# Altium schematic sheet 2_MEMORY.schdoc
size 307 x 218 mm; Symbol: Drawing-Symbol_A4; Device: Drawing-Symbol_A4; Company: 嘉立创EDA; Version: V1.0; Page Size: A4; @Project Name: 工程文件; @Page Count: 7; @Update Date: 2025-06-13; @Create Date: 2025-06-12; @Schematic Name: Schematic1; @Page No: 2; @Page Name: MEMORY; @Create Time: 03:04:20; @Update Time: 17:04:07; Width: 1170; Height: 825; Region Start: 1; X Region Count: 6; Y Region Count: 4; Blade Width: 10; Title Block Position: 3; @Board Name: Board1
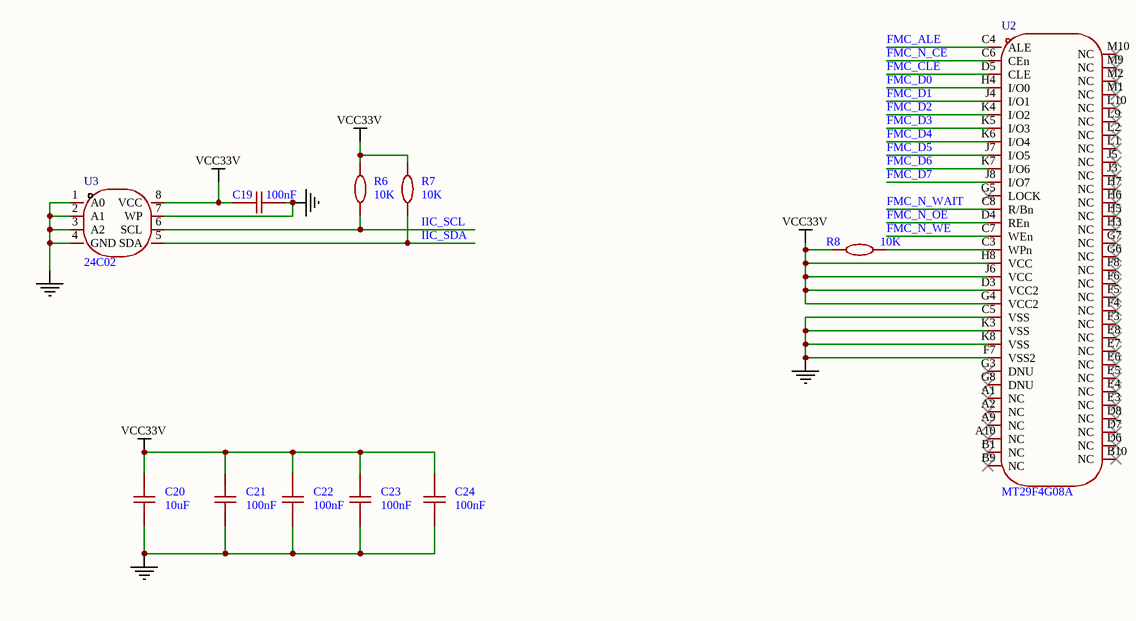
[diagram p0: 2_MEMORY.schdoc]

## Parts
C19  100nF  [C0402]
C20  10uF  [C0603]
C21  100nF  [C0402]
C22  100nF  [C0402]
C23  100nF  [C0402]
C24  100nF  [C0402]
R6  10K  [R0402]
R7  10K  [R0402]
R8  10K  [R0402]
U2  MT29F4G08A  [VFBGA-63_L11.0-W9.0-P0.80-BL_MT29F2G08ABAEAH4-IT-E]
U3  24C02  [SOP-8_L4.9-W3.9-P1.27-LS6.0-BL]

## Nets
DGND: C19.1 C20.1 C21.1 C22.1 C23.1 C24.1 U2.C5(VSS) U2.F7(VSS2) U2.K3(VSS) U2.K8(VSS) U3.1(A0) U3.2(A1) U3.3(A2) U3.4(GND) U3.7(WP)
VCC33V: C19.2 C20.2 C21.2 C22.2 C23.2 C24.2 R6.2 R7.2 R8.1 U2.D3(VCC2) U2.G4(VCC2) U2.H8(VCC) U2.J6(VCC) U3.8(VCC)
FMC_ALE: U2.C4(ALE)
FMC_CLE: U2.D5(CLE)
FMC_D0: U2.H4(I/O0)
FMC_D1: U2.J4(I/O1)
FMC_D2: U2.K4(I/O2)
FMC_D3: U2.K5(I/O3)
FMC_D4: U2.K6(I/O4)
FMC_D5: U2.J7(I/O5)
FMC_D6: U2.K7(I/O6)
FMC_D7: U2.J8(I/O7)
FMC_N_CE: U2.C6(CEn)
FMC_N_OE: U2.D4(REn)
FMC_N_WAIT: U2.C8(R/Bn)
FMC_N_WE: U2.C7(WEn)
IIC_SCL: R6.1 U3.6(SCL)
IIC_SDA: R7.1 U3.5(SDA)
NetR8_2: R8.2 U2.C3(WPn)

Not connected (* = marked no-connect by the designer): U2 A1(NC)* A2(NC)* A9(NC)* A10(NC)* B1(NC)* B9(NC)* B10(NC)* D6(NC)* D7(NC)* D8(NC)* E3(NC)* E4(NC)* E5(NC)* E6(NC)* E7(NC)* E8(NC)* F3(NC)* F4(NC)* F5(NC)* F6(NC)* F8(NC)* G3(DNU)* G5(LOCK)* G6(NC)* G7(NC)* G8(DNU)* H3(NC)* H5(NC)* H6(NC)* H7(NC)* J3(NC)* J5(NC)* L1(NC)* L2(NC)* L9(NC)* L10(NC)* M1(NC)* M2(NC)* M9(NC)* M10(NC)*

## Notes on the sheet
- 1
- 2
- 3
- 4
- 5
- 6
- A
- B
- C
- D

## Library data of the parts
C19 C21-C24 = CAP_0402: Symbol: CapAcitance; Convert to PCB: yes; Device: CAP_0402; Add into BOM: yes; Value: 100nF
C20 = CAP_0603: Symbol: CapAcitance; Convert to PCB: yes; Device: CAP_0603; Add into BOM: yes; Value: 10uF
R6-R8 = Res_0402: Symbol: 电阻; Convert to PCB: yes; Device: Res_0402; Add into BOM: yes; Value: 10K
U2 = MT29F4G08A: Add into BOM: yes; Symbol: MT29F4G08A; Device: MT29F4G08A; Manufacturer Part: MT29F4G08A; Convert to PCB: yes
U3 = 24C02: Add into BOM: yes; Symbol: 24C02; Device: 24C02; Manufacturer Part: 24C02; Convert to PCB: yes